# Altium schematic sheet schMapaSensorChassi.SchDoc
size A4
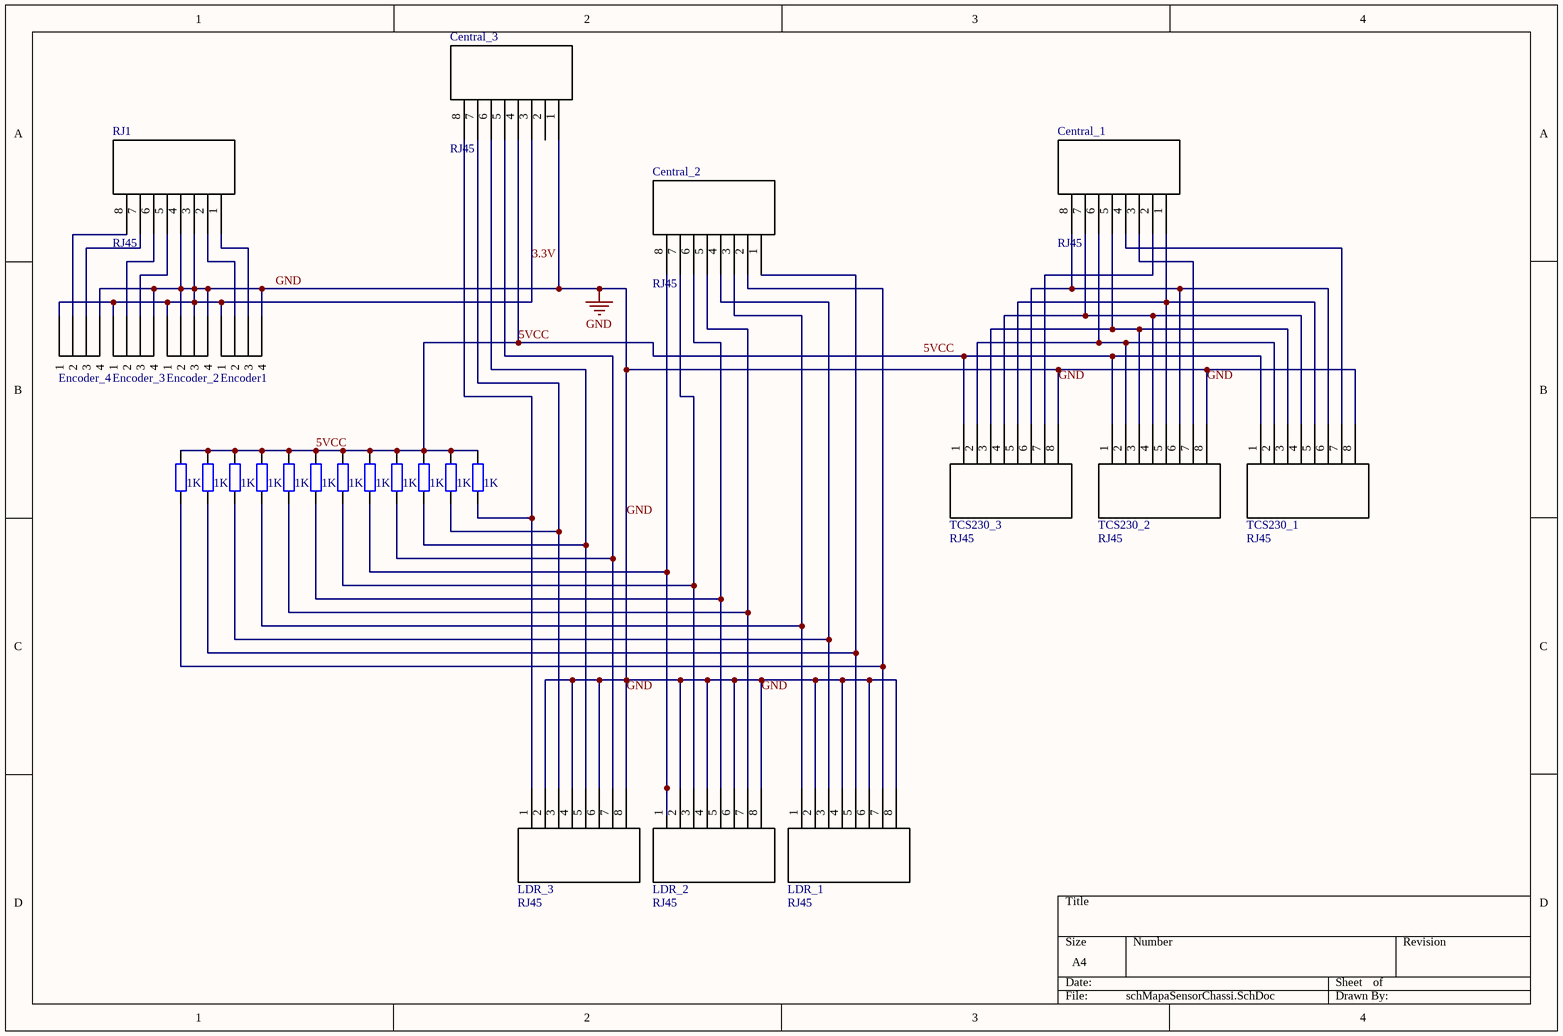
[diagram p0: schMapaSensorChassi.SchDoc]

## Parts
Central_1  RJ45  [RJ45_90]
Central_2  RJ45  [RJ45_90]
Central_3  RJ45  [RJ45_90]
Encoder_1  Encoder1  [4-vias]
Encoder_2  Encoder_2  [4-vias]
Encoder_3  Encoder_3  [4-vias]
K3  Encoder_4  [4-vias]
LDR_1  RJ45  [RJ45_Simples]
LDR_2  RJ45  [RJ45_Simples]
LDR_3  RJ45  [RJ45_Simples]
R1  value 1K  [AXIAL-0.4]  (hidden comment: Res2)
R2  value 1K  [AXIAL-0.4]  (hidden comment: Res2)
R3  value 1K  [AXIAL-0.4]  (hidden comment: Res2)
R4  value 1K  [AXIAL-0.4]  (hidden comment: Res2)
R5  value 1K  [AXIAL-0.4]  (hidden comment: Res2)
R6  value 1K  [AXIAL-0.4]  (hidden comment: Res2)
R7  value 1K  [AXIAL-0.4]  (hidden comment: Res2)
R8  value 1K  [AXIAL-0.4]  (hidden comment: Res2)
R9  value 1K  [AXIAL-0.4]  (hidden comment: Res2)
R10  value 1K  [AXIAL-0.4]  (hidden comment: Res2)
R11  value 1K  [AXIAL-0.4]  (hidden comment: Res2)
R12  value 1K  [AXIAL-0.4]  (hidden comment: Res2)
RJ1  RJ45  [RJ45_90]
TCS230_1  RJ45  [RJ45_90]
TCS230_2  RJ45  [RJ45_90]
TCS230_3  RJ45  [RJ45_Simples]

## Nets
3.3V: Central_3.1 Central_3.3 Encoder_1.1 Encoder_1.4 Encoder_2.1 Encoder_2.2 Encoder_2.3 Encoder_2.4 Encoder_3.1 Encoder_3.4 K3.1 K3.4 LDR_1.2 LDR_1.4 LDR_1.6 LDR_1.8 LDR_2.2 LDR_2.4 LDR_2.6 LDR_2.8 LDR_3.2 LDR_3.4 LDR_3.6 LDR_3.8 RJ1.3 RJ1.4 TCS230_1.8 TCS230_2.8 TCS230_3.8  [also labelled GND]
5VCC: Central_3.4 R1.2 R2.2 R3.2 R4.2 R5.2 R6.2 R7.2 R8.2 R9.2 R10.2 R11.2 R12.2 TCS230_1.1 TCS230_2.1 TCS230_3.1
NetCentral_1_1: Central_1.1 TCS230_1.5 TCS230_2.5 TCS230_3.5
NetCentral_1_2: Central_1.2 TCS230_3.7
NetCentral_1_3: Central_1.3 TCS230_2.7
NetCentral_1_4: Central_1.4 TCS230_1.7
NetCentral_1_5: Central_1.5 TCS230_1.3 TCS230_2.3 TCS230_3.3
NetCentral_1_6: Central_1.6 TCS230_1.2 TCS230_2.2 TCS230_3.2
NetCentral_1_7: Central_1.7 TCS230_1.4 TCS230_2.4 TCS230_3.4
NetCentral_1_8: Central_1.8 TCS230_1.6 TCS230_2.6 TCS230_3.6
NetCentral_2_1: Central_2.1 LDR_1.5 R2.1
NetCentral_2_2: Central_2.2 LDR_1.7 R1.1
NetCentral_2_3: Central_2.3 LDR_1.1 R4.1
NetCentral_2_4: Central_2.4 LDR_1.3 R3.1
NetCentral_2_5: Central_2.5 LDR_2.7 R5.1
NetCentral_2_6: Central_2.6 LDR_2.5 R6.1
NetCentral_2_7: Central_2.7 LDR_2.3 R7.1
NetCentral_2_8: Central_2.8 LDR_2.1 R8.1
NetCentral_3_5: Central_3.5 LDR_3.7 R9.1
NetCentral_3_6: Central_3.6 LDR_3.5 R10.1
NetCentral_3_7: Central_3.7 LDR_3.3 R11.1
NetCentral_3_8: Central_3.8 LDR_3.1 R12.1
NetEncoder_1_2: Encoder_1.2 RJ1.2
NetEncoder_1_3: Encoder_1.3 RJ1.1
NetEncoder_3_2: Encoder_3.2 RJ1.6
NetEncoder_3_3: Encoder_3.3 RJ1.5
NetK3_2: K3.2 RJ1.8
NetK3_3: K3.3 RJ1.7

Not connected (* = marked no-connect by the designer): Central_3 2

## Library data of the parts
Encoder_1-Encoder_3 K3 = KK4Vias: ComponentLink1Description: Fabricante; ComponentLink1URL: https://www.molex.com/molex/products/family?key=kk_254_rpc_connector_system&channel=products&chanName=family&pageTitle=Introduction&parentKey=kk_interconnect_solutions
R1-R12 = Res2: Resistor; Published: 8-Jun-2000; LatestRevisionDate: 17-Jul-2002; LatestRevisionNote: Re-released for DXP Platform.; PackageReference: AXIAL-0.4; Publisher: Altium Limited; PackageDescription: Axial Device, Thru-Hole; 2 Leads; 0.4 in Pin Spacing